# Altium schematic sheet ADC-POWER SUPPLY.SchDoc: <SPECIFIC SHEET FUNCTION>
size A3; Date: DO NOT USE, RATHER USE PROJ OPTIONS; DrawnBy: DO NOT USE, RATHER USE PROJ OPTIONS; Engineer: DO NOT USE, RATHER USE PROJ OPTIONS; Organization: DO NOT USE, RATHER USE PROJ OPTIONS; DocumentNumber: 12; Revision: DO NOT USE, RATHER USE PROJ OPTIONS; SheetNumber: 11; SheetTotal: 12; SCH_Sheet_Filename: ADC-POWER SUPPLY.SchDoc; CurrentTime: DO NOT USE, RATHER USE PROJ OPTIONS; Time: DO NOT USE, RATHER USE PROJ OPTIONS; DocumentFullPathAndName: DO NOT USE, RATHER USE PROJ OPTIONS; DocumentName: DO NOT USE, RATHER USE PROJ OPTIONS; ModifiedDate: DO NOT USE, RATHER USE PROJ OPTIONS; ImagePath: DO NOT USE, RATHER USE PROJ OPTIONS
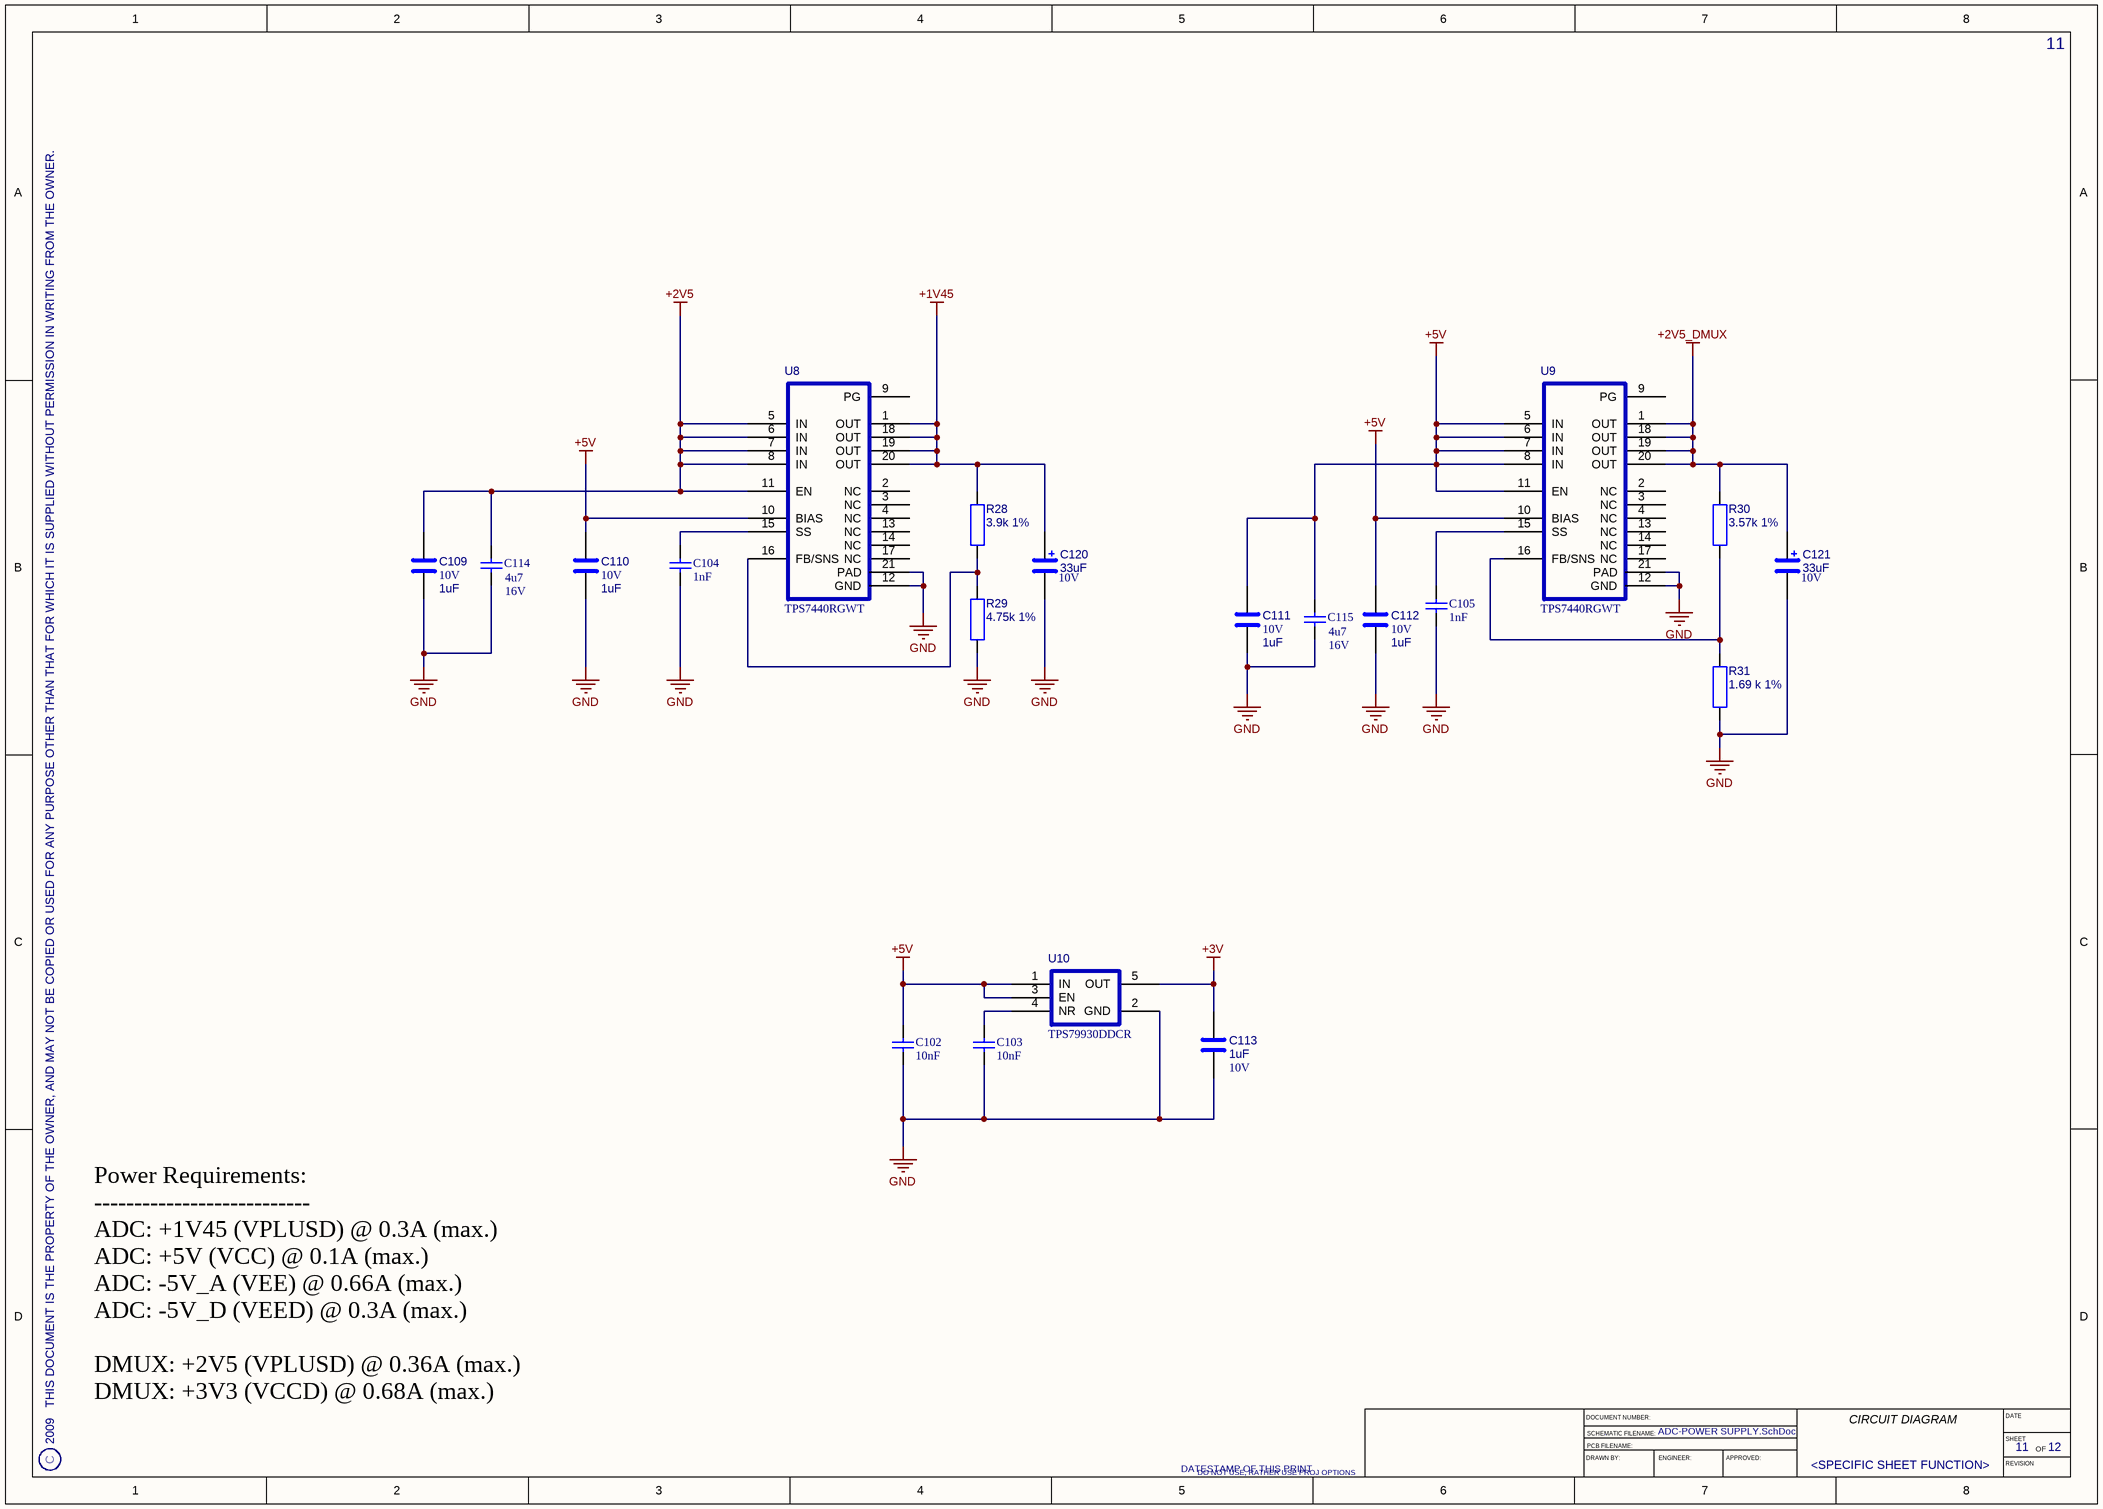
[diagram p0: ADC-POWER SUPPLY.SchDoc]

## Parts
C102  value 10nF  [CAPC1005X55N]  (hidden comment: Capacitor 0402 SMD)
C103  value 10nF  [CAPC1005X55N]  (hidden comment: Capacitor 0402 SMD)
C104  value 1nF  [CAPC1005X55N]  (hidden comment: Capacitor 0402 SMD)
C105  value 1nF  [CAPC1005X55N]  (hidden comment: Capacitor 0402 SMD)
C109  value 1uF  Voltage: 10V  [CAPC1632X80USR]  (hidden comment: CAP SMD 1206)
C110  value 1uF  Voltage: 10V  [CAPC1632X80USR]  (hidden comment: CAP SMD 1206)
C111  value 1uF  Voltage: 10V  [CAPC1632X80USR]  (hidden comment: CAP SMD 1206)
C112  value 1uF  Voltage: 10V  [CAPC1632X80USR]  (hidden comment: CAP SMD 1206)
C113  value 1uF  Voltage: 10V  [CAPC1632X80USR]  (hidden comment: CAP SMD 1206)
C114  value 4u7  Voltage: 16V  [CAPC3225X220N]  (hidden comment: Capacitor 1210 SMD)
C115  value 4u7  Voltage: 16V  [CAPC3225X220N]  (hidden comment: Capacitor 1210 SMD)
C120  Voltage: 10V  [3528]  (hidden comment: 33uF)
C121  Voltage: 10V  [3528]  (hidden comment: 33uF)
R28  3.9k 1%  [0603]
R29  4.75k 1%  [0603]
R30  3.57k 1%  [0603]
R31  1.69 k 1%  [0603]
U8  TPS7440RGWT  [QFN65P500X500X100-21AN]
U9  TPS7440RGWT  [QFN65P500X500X100-21AN]
U10  TPS79930DDCR  [SOT95P280X110-5USR2]

## Nets
+1V45: C120.1 R28.1 U8.1(OUT) U8.18(OUT) U8.19(OUT) U8.20(OUT)
+2V5: C109.1 C114.2 U8.5(IN) U8.6(IN) U8.7(IN) U8.8(IN) U8.11(EN)
+2V5_DMUX: C121.1 R30.1 U9.1(OUT) U9.18(OUT) U9.19(OUT) U9.20(OUT)
+3V: C113.1 U10.5(OUT)
+5V: C102.1 C110.1 C111.1 C112.1 C115.2 U8.10(BIAS) U9.5(IN) U9.6(IN) U9.7(IN) U9.8(IN) U9.10(BIAS) U9.11(EN) U10.1(IN) U10.3(EN)
GND: C102.2 C103.2 C104.1 C105.1 C109.2 C110.2 C111.2 C112.2 C113.2 C114.1 C115.1 C120.2 C121.2 R29.1 R31.1 U8.12(GND) U8.21(PAD) U9.12(GND) U9.21(PAD) U10.2(GND)
NetC103_1: C103.1 U10.4(NR)
NetC104_2: C104.2 U8.15(SS)
NetC105_2: C105.2 U9.15(SS)
NetR28_2: R28.2 R29.2 U8.16(FB/SNS)
NetR30_2: R30.2 R31.2 U9.16(FB/SNS)

Not connected (* = marked no-connect by the designer): U8 2(NC) 3(NC) 4(NC) 9(PG) 13(NC) 14(NC) 17(NC); U9 2(NC) 3(NC) 4(NC) 9(PG) 13(NC) 14(NC) 17(NC)

## Notes on the sheet
- Power Requirements:
  ---------------------------
  ADC: +1V45 (VPLUSD) @ 0.3A (max.)
  ADC: +5V (VCC) @ 0.1A (max.)
  ADC: -5V_A (VEE) @ 0.66A (max.)
  ADC: -5V_D (VEED) @ 0.3A (max.)
  DMUX: +2V5 (VPLUSD) @ 0.36A (max.)
  DMUX: +3V3 (VCCD) @ 0.68A (max.)
- 2009   THIS DOCUMENT IS THE PROPERTY OF THE OWNER, AND MAY NOT BE COPIED OR USED FOR ANY PURPOSE OTHER THAN THAT FOR WHICH IT IS SUPPLIED WITHOUT PERMISSION IN WRITING FROM THE OWNER.
- C
- DATESTAMP OF THIS PRINT
- DRAWN BY:
- DOCUMENT NUMBER:
- SCHEMATIC FILENAME:
- PCB FILENAME:
- ENGINEER:
- APPROVED:
- CIRCUIT DIAGRAM
- DATE
- SHEET
- REVISION
- OF

## Library data of the parts
C102-C105 = cap0402: Created_By: EDA-ASA; Checked_By: *; Checked_Date: *; HelpURL: *; Supplier1: *; Supplier2: *; Unit_Cost: *; MOQ: *; Leadtime: *; Inventory_Stock: *; Tolerance: *; Wattage: *; Package: 0402; ComponentLinked1Description: *; ComponentLinked1URL: *; ComponentLinked2Description: *; ComponentLinked2URL: *; ComponentLinked3Description: *; ComponentLinked3URL: *; ComponentLinked4Description: *; ComponentLinked4URL: *
C109-C113 = CAP-0603: Manufacturer: *; Manufacturer_PN: *; Created_By: *; Checked_By: *; Checked_Date: *; HelpURL: *; ComponentLink1Description: Footprint Detail; ComponentLink1URL: *; ComponentLink2Description: Application Note; ComponentLink2URL: *; ComponentLink3Description: Layout Guidelines; ComponentLink3URL: *; ComponentLink4Description: Technology Reference; ComponentLink4URL: *; Supplier1: *; Supplier2: *; Unit_Cost: *; MOQ: *; Leadtime: *; Inventory_Stock: *; Tolerance: *; Wattage: *; Package: 1206; ComponentLink5Description: Production Detail; ComponentLink5URL: *; Note: *; Stock Code: *
C114 C115 = cap1210: Created_By: EDA-ASA; Checked_By: *; Checked_Date: *; HelpURL: *; Supplier1: *; Supplier2: *; Unit_Cost: *; MOQ: *; Leadtime: *; Inventory_Stock: *; Tolerance: *; Wattage: *; Package: 1210; ComponentLinked1Description: *; ComponentLinked1URL: *; ComponentLinked2Description: *; ComponentLinked2URL: *; ComponentLinked3Description: *; ComponentLinked3URL: *; ComponentLinked4Description: *; ComponentLinked4URL: *
C120 C121 = CAPACITOR-POLARISED: Created_By: EDA-ASA; Checked_By: *; Checked_Date: *; HelpURL: *; ComponentLinked1Description: *; ComponentLinked1URL: *; ComponentLinked2Description: *; ComponentLinked2URL: *; ComponentLinked3Description: *; ComponentLinked3URL: *; ComponentLinked4Description: *; ComponentLinked4URL: *; Supplier1: *; Supplier2: *; Unit_Cost: *; MOQ: *; Leadtime: *; Inventory_Stock: *; Tolerance: *; Wattage: *; Value: 33uF
R28-R31 = RES-0805: RESISTOR SMD 0603; Checked_By: NN; Manufacturer: *; Manufacturer_PN: *; Created_By: *; Checked_Date: 5-08-2009; HelpURL: *; ComponentLink1Description: Footprint Detail; ComponentLink1URL: *; ComponentLink2Description: Application Note; ComponentLink2URL: *; ComponentLink3Description: Layout Guidelines; ComponentLink3URL: *; ComponentLink4Description: Technology Reference; ComponentLink4URL: *; Supplier1: *; Supplier2: *; Unit_Cost: *; MOQ: *; Leadtime: *; Inventory_Stock: *; Tolerance: *; Wattage: *; Voltage: *; Package: 0603; ComponentLink5Description: Production Detail; ComponentLink5URL: *; Note: *; Stock Code: *
  R28: Value: 3.9k 1%
  R29: Value: 4.75k 1%
  R30: Value: 3.57k 1%
  R31: Value: 1.69 k 1%
U8 U9 = TPS74401RGWT: 3.0A Ultra-LDO with Programmable Soft-Start; Manufacturer: TI; Created_By: IN; Manufacturer_PN: TPS7440RGWT; Checked_By: *; Checked_Date: *; HelpURL: X:\Datasheets\By Manufacturer\TI\tps74401.pdf; ComponentLink1Description: Footprint Detail; ComponentLink1URL: X:\Datasheets\By Manufacturer\TI\tps74401.pdf#page=12; ComponentLink2Description: Application Note; ComponentLink2URL: X:\Datasheets\By Manufacturer\TI\tps74401.pdf#page=13; ComponentLink3Description: Layout Guidelines; ComponentLink3URL: X:\Datasheets\By Manufacturer\TI\tps74401.pdf#page=14; ComponentLink4Description: Technology Reference; ComponentLink4URL: X:\Datasheets\By Manufacturer\TI\tps74401.pdf#page=15; Supplier1: *; Supplier2: *; Unit_Cost: *; MOQ: *; Leadtime: *; Inventory_Stock: *; Tolerance: *; Wattage: *; Voltage: *; Package: *; ComponentLink5Description: Production Detail; ComponentLink5URL: *; Note: *; Stock Code: *
U10 = TPS7994DDCR: Low Quiescent Current, Ultra-Low Noise Dropout Linear Regulator; Manufacturer: TI; Created_By: IN; Manufacturer_PN: TPS79930DDCR; Checked_By: *; Checked_Date: *; HelpURL: X:\Datacheets\By_Manufacture\TI\296-17776-2.pdf; ComponentLink1Description: Footprint Detail; ComponentLink1URL: *; ComponentLink2Description: Application Note; ComponentLink2URL: *; ComponentLink3Description: Layout Guidelines; ComponentLink3URL: *; ComponentLink4Description: Technology Reference; ComponentLink4URL: *; Supplier1: *; Supplier2: *; Unit_Cost: *; MOQ: *; Leadtime: *; Inventory_Stock: *; Tolerance: *; Wattage: *; Voltage: *; Package: *; ComponentLink5Description: Production Detail; ComponentLink5URL: *; Note: *; Stock Code: *